# EAGLE design Optoisolator Relay (EAGLE 9.6.2)
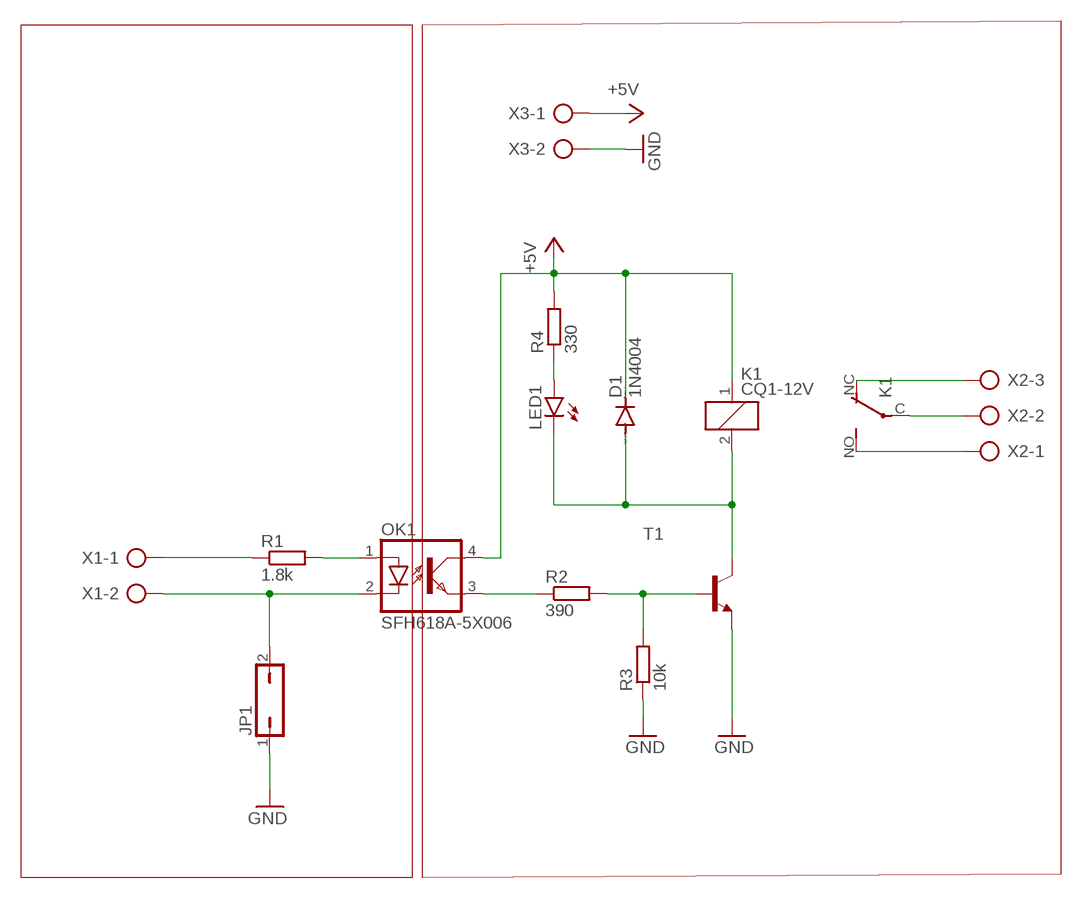
[diagram p0: schematic, sheet 1]

## Parts
D1  1N4004  [DO41-10]
JP1  JP1Q  [JP1]
K1  CQ1-12V  [CQ1]
LED1  LED3MM  [LED3MM]
OK1  SFH618A-5X006  [DIP4-400]
R1  1.8k  R-EU_0204/7  [0204/7]
R2  390  R-EU_0204/7  [0204/7]
R3  10k  R-EU_0204/7  [0204/7]
R4  330  R-EU_0204/7  [0204/7]
T1  2N2222-NPN-TO92-EBC  [TO92-EBC]
X1  AK300/2  [AK300/2]
X2  AK300/3  [AK300/3]
X3  AK300/2  [AK300/2]

## Nets
+5V: D1.C K1.1 OK1.4(COL) R4.2 X3.1
GND: JP1.1 R3.1 T1.E X3.2
N$1: R1.1 X1.1
N$2: OK1.1(A) R1.2
N$3: D1.A K1.2 LED1.K(C) T1.C
N$4: OK1.3(EMIT) R2.1
N$5: R2.2 R3.2 T1.B
N$6: LED1.A R4.1
N$7: K1.C(2:P) X2.2
N$8: K1.NO(2:S) X2.1
N$9: K1.NC(2:O) X2.3
N$10: JP1.2 OK1.2(C) X1.2

## Library data of the parts
D1 = diode:1N4004: DIODE general purpose rectifier, 1 A
JP1 = jumper:JP1Q: JUMPER
K1 = relay:CQ1-12V: AUTOMOTIVE QUIET RELAY NAiS Source: http://www.mew-europe.com/.. en_ds_61208_0000.pdf; OC_FARNELL: unknown; OC_NEWARK: unknown
LED1 = led:LED: LED OSRAM: - CHIPLED LG R971, LG N971, LY N971, LG Q971, LY Q971, LO R971, LY R971 LH N974, LH R974 LS Q976, LO Q976, LY Q976 LO Q996 - Hyper CHIPLED LW Q18S LB Q993, LB Q99A, LB R99A - SideLED LS A670, LO A670, LY A670, LG A670, LP A670 LB A673, LV A673, LT A673, LW A673 LH A674 LY A675 LS A676, LA A676, LO A676, LY A676, LW A676 LS A679, LY A679, LG A679 - Hyper Micro SIDELED® LS Y876, LA Y876, LO Y876, LY Y876 LT Y87S - SmartLED LW L88C, LW L88S LB L89C, LB L89S, LG L890 LS L89K, LO L89K, LY L89K LS L896, LA L896, LO L896, LY L896 - TOPLED LS T670, LO T670, LY T670, LG T670, LP T670 LSG T670, LSP T670, LSY T670, LOP T670, LYG T670 LG T671, LOG T671, LSG T671 LB T673, LV T673, LT T673, LW T673 LH T674 LS T676, LA T676, LO T676, LY T676, LB T676, LH T676, LSB T676, LW T676 LB T67C, LV T67C, LT T67C, LS T67K, LO T67K, LY T67K, LW E67C LS E67B, LA E67B, LO E67B, LY E67B, LB E67C, LV E67C, LT E67C LW T67C LS T679, LY T679, LG T679 LS T770, LO T770, LY T770, LG T770, LP T770 LB T773, LV T773, LT T773, LW T773 LH T774 LS E675, LA E675, LY E675, LS T675 LS T776, LA T776, LO T776, LY T776, LB T776 LHGB T686 LT T68C, LB T68C - Hyper Mini TOPLED® LB M676 - Mini TOPLED Santana® LG M470 LS M47K, LO M47K, LY M47K Source: http://www.osram.convergy.de LUXEON: - LUMILED® LXK2-PW12-R00, LXK2-PW12-S00, LXK2-PW14-U00, LXK2-PW14-V00 LXK2-PM12-R00, LXK2-PM12-S00, LXK2-PM14-U00 LXK2-PE12-Q00, LXK2-PE12-R00, LXK2-PE12-S00, LXK2-PE14-T00, LXK2-PE14-U00 LXK2-PB12-K00, LXK2-PB12-L00, LXK2-PB12-M00, LXK2-PB14-N00, LXK2-PB14-P00, LXK2-PB14-Q00 LXK2-PR12-L00, LXK2-PR12-M00, LXK2-PR14-Q00, LXK2-PR14-R00 LXK2-PD12-Q00, LXK2-PD12-R00, LXK2-PD12-S00 LXK2-PH12-R00, LXK2-PH12-S00 LXK2-PL12-P00, LXK2-PL12-Q00, LXK2-PL12-R00 Source: www.luxeon.com KINGBRIGHT: KA-3528ASYC Source: www.kingbright.com
OK1 = optocoupler:SFH618?*: Optocoupler, Phototransistor Output, Low Input Current Source: Data sheet <http://www.vishay.com/docs/83673/sfh618.pdf>; OC_FARNELL: unknown; OC_NEWARK: unknown
R1-R4 = rcl:R-EU_: RESISTOR, European symbol; SPICEPREFIX: R
T1 = transistor-neu-to92:*-NPN-: NPN Transistror
X1 X3 = con-ptr500:AK300/2: CONNECTOR; OC_FARNELL: unknown; OC_NEWARK: unknown
X2 = con-ptr500:AK300/3: CONNECTOR; OC_FARNELL: unknown; OC_NEWARK: unknown

## Board
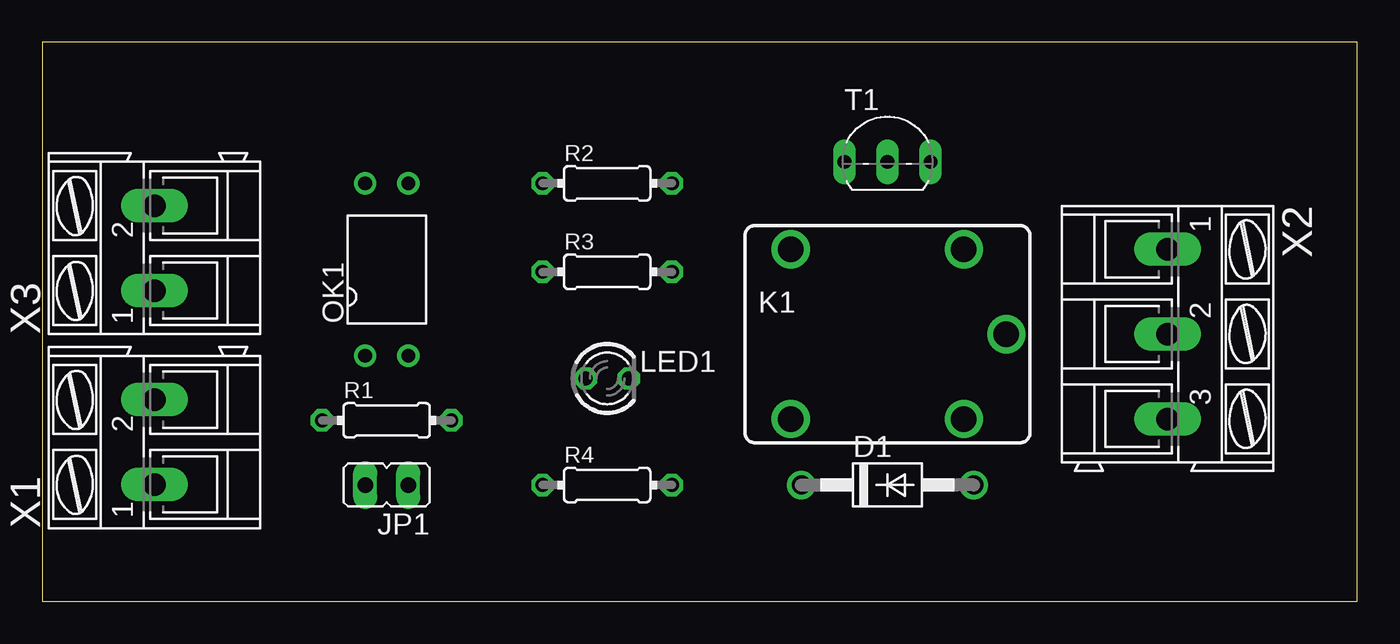
[diagram p1: board, top side]
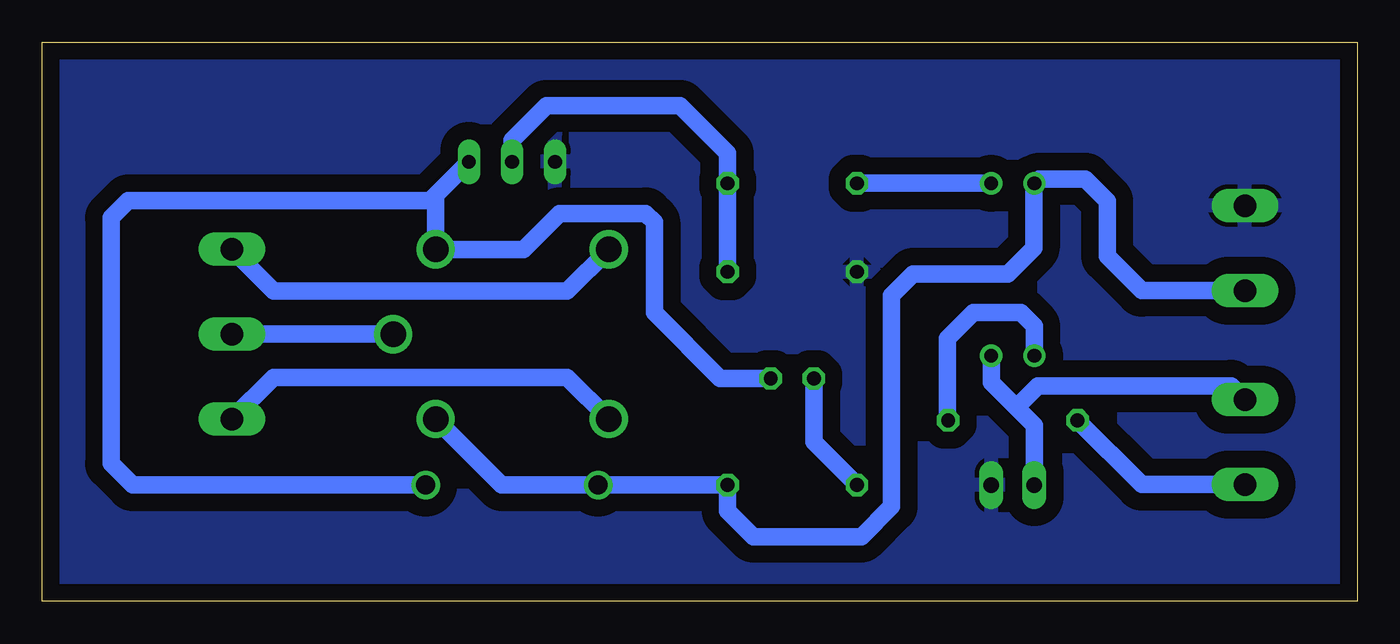
[diagram p2: board, bottom side, seen from below]

Size 77.45 x 32.94 mm. Coordinates in mm from the lower left corner, seen from the top.
Outline: 0,0 77.45,0 77.45,32.94 0,32.94 0,0
Copper layers (1*16): Top 0.035mm / dielectric 1.5mm / Bottom 0.035mm
Design rules "default *": minimum track width 40mil, minimum drill 0.35mm, track to track 16mil, track to pad 16mil, pad to pad 6mil, via to via 6mil, smd to smd 6mil, copper to edge 40mil, drill to drill 6mil, minimum pad ring 10mil, minimum via ring 8mil, stop-mask expansion 4mil, vias tented up to drill 0mil, thermal gap 10mil

### Footprints (pad centres in the part's own frame; a part is rotated, then mirrored left to right if it is on the bottom)
DO41-10 = drill 1.118: A 5.08,0; C -5.08,0
JP1 = drill 0.914 long: 1 0,-1.27; 2 0,1.27
CQ1 = drill 1.5: 1 4.5,-5; 2 4.5,5; C 7,0; NC -5.7,-5; NO -5.7,5
LED3MM = drill 0.813 octagon: A -1.27,0; K 1.27,0
DIP4-400 = drill 0.8: 1 -1.27,-5.08; 2 1.27,-5.08; 3 1.27,5.08; 4 -1.27,5.08
0204/7 = drill 0.813 octagon: 1 -3.81,0; 2 3.81,0
TO92-EBC = drill 0.813 long: B 0,-1.27; C 2.54,-1.27; E -2.54,-1.27
AK300/2 = drill 1.321 long: 1 -2.515,0; 2 2.489,0
AK300/3 = drill 1.321 long: 1 -5.004,0; 2 0,0; 3 5.004,0

### Placement (x,y rotation side)
D1  49.78,6.86 0 top
JP1  20.28,6.86 90 top
K1  49.78,15.75 0 top
LED1  33.27,13.14 0 top
OK1  20.28,19.56 0 top
R1  20.28,10.67 0 top
R2  33.27,24.64 0 top
R3  33.27,19.42 0 top
R4  33.27,6.86 0 top
T1  49.78,27.18 0 top
X1  6.6,9.4 90 top
X2  66.29,15.75 270 top
X3  6.6,20.83 90 top

### Tracks (layer width: path | path; a pad name or v marks a point on that pad's centre or on a via)
+5V
  Bottom 1.016: X3.1 12.69,18.31 14.71,20.34 14.71,23.6 16,24.89 18.76,24.89 OK1.4 19.05,24.6 19.05,20.83 20.57,19.3 26.16,19.3 27.43,18.03 27.43,5.59 29.21,3.81 35.56,3.81 37.08,5.33 R4.2 D1.C 50.39,6.86 K1.1
GND
  pour Bottom (isolate 1.016): -1.02,39.88 82.8,39.88 82.8,-4.57 -1.02,-4.57
N$1
  Bottom 1.016: R1.1 12.69,6.88 X1.1
N$2
  Bottom 1.016: OK1.1 19.01,16.22 19.81,17.02 22.61,17.02 24.13,15.49 24.13,10.71 R1.2
N$3
  Bottom 1.016: T1.C 54.28,23.95 | 54.28,23.95 K1.2 49.1,20.75 46.99,22.86 41.91,22.86 41.4,22.35 41.4,17.02 37.52,13.14 LED1.K | 54.28,23.95 54.61,23.62 72.39,23.62 73.41,22.61 73.41,8.13 72.14,6.86 D1.A
N$4
  Bottom 1.016: R2.1 OK1.3
N$5
  Bottom 1.016: R3.2 R2.2 37.08,26.42 39.88,29.21 47.75,29.21 49.78,27.18 T1.B
N$6
  Bottom 1.016: LED1.A 32,9.4 R4.1
N$7
  Bottom 1.016: K1.C X2.2
N$8
  Bottom 1.016: K1.NO 46.54,18.29 63.83,18.29 X2.1
N$9
  Bottom 1.016: K1.NC 46.54,13.21 63.83,13.21 X2.3
N$10
  Bottom 1.016: OK1.2 21.55,12.92 20.07,11.43 | JP1.2 19.01,10.38 20.07,11.43 | 20.07,11.43 18.8,12.7 7.42,12.7 X1.2